# EasyEDA Pro project ESP32_Pico.eprj

# Board PCB1
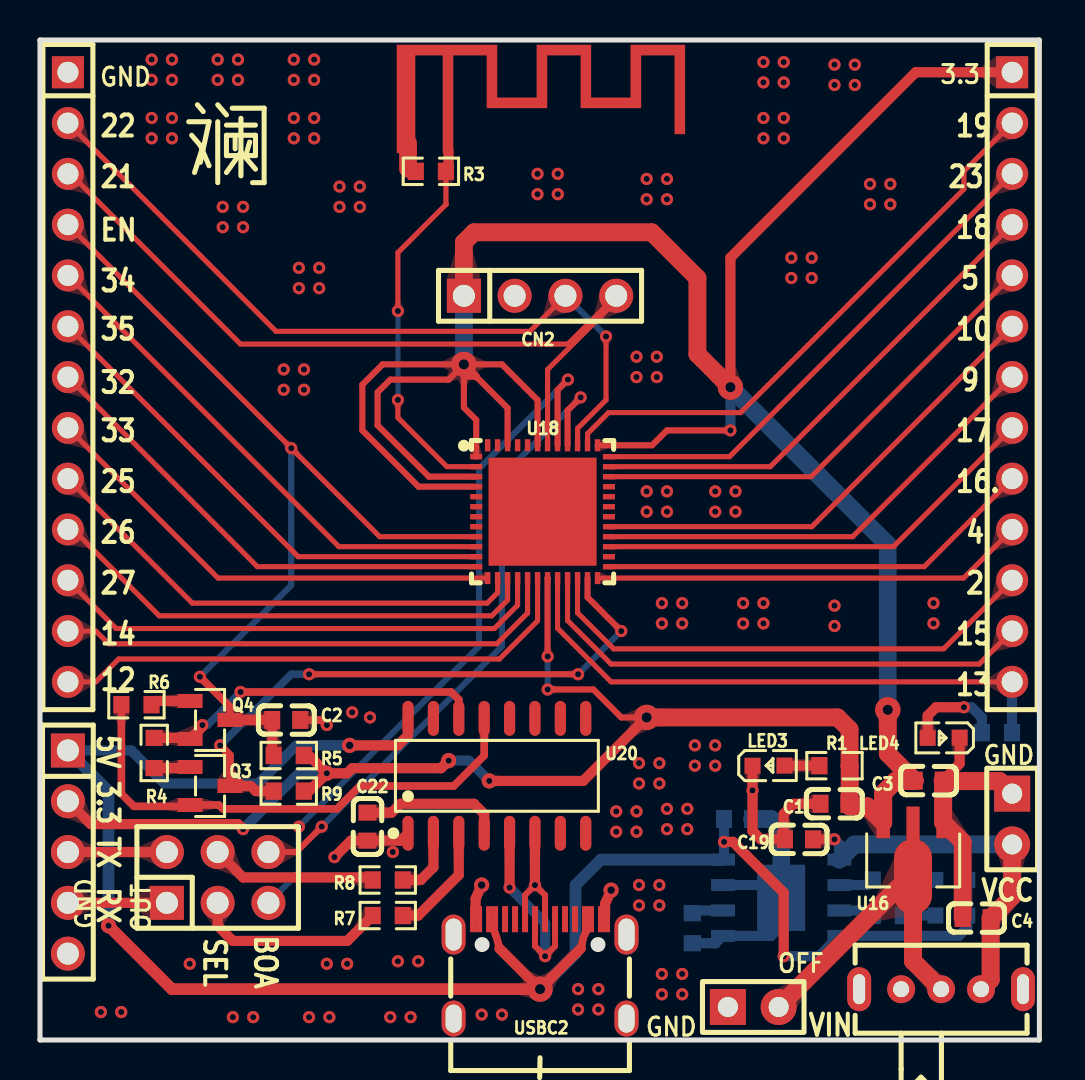
[diagram p0: board, top side]
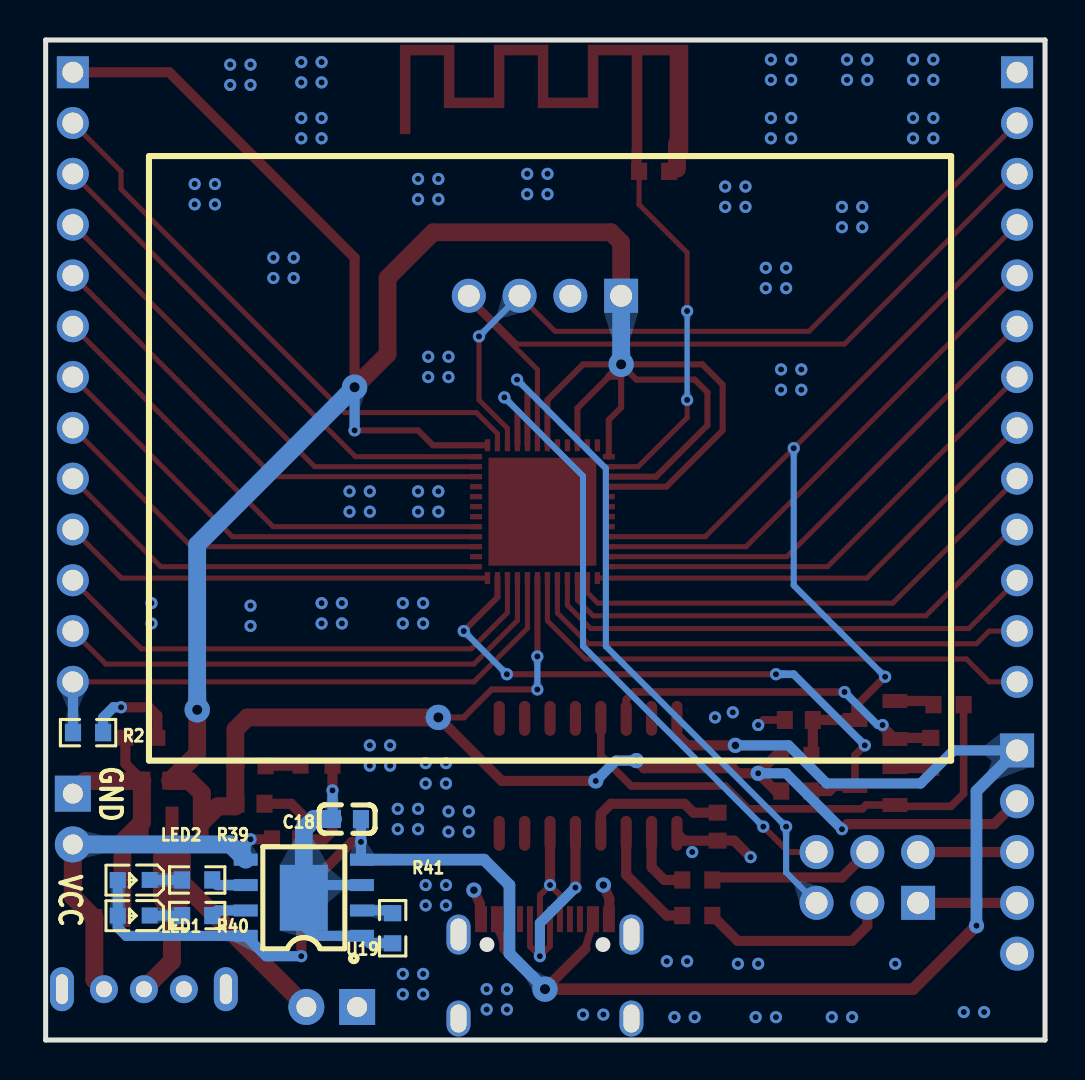
[diagram p1: board, bottom side, seen from below]

Outline 50 x 50 mm; copper layers: Top Layer, Bottom Layer. Coordinates in mm from the lower left corner of the outline.
Outline path: 0,50 0,0 50,0 50,50 0,50
Stack: Top Layer 0.035mm / Dielectric1 1.51mm FR4 er 4.5 / Bottom Layer 0.035mm

## Design rules (mm)
spacing safeClearance (default): track to track 0.152, other pairs 0.152 to 0.3
track width trackWidth (default): min 0.127, default 0.254, max 2.54
differential pair differentialPair (default): width min 0.127, default 0.254, max 2.54; gap min 0.152, default 0.152
via viaSize (default): diameter min 0.5, default 0.61, max 10; hole min 0.3, default 0.305, max 6

## Placement (name value [footprint] x y rotation side)
3.3  PZ254-1-13-Z-8.5  [HDR-TH_13P-P2.54-V-M]  48.64 33.15 270 top
C1  100nF  [C0603]  39.75 11.81 0 top
C2  1UF  [C0603]  12.32 16 180 top
C3  10uF  [C0603]  44.46 12.97 0 top
C4  100nF  [C0603]  46.86 6.1 0 top
C18  10uF  [C0603]  34.93 11.05 0 bottom
C19  10uF  [C0603]  37.97 10.03 180 top
C22  100nF  [C0603]  16.38 10.67 270 top
CN2  A2541WV-4P  [HDR-TH_4P-P2.54-V-M]  25.02 37.21 0 top
GND  -  [HDR-TH_13P-P2.54-V-M]  1.4 33.15 270 top
GND#2  -  [HDR-TH_5P-P2.54-V-M]  1.4 9.4 270 top
GND#3  -  [HDR-TH_2P-P2.54-V-M-1]  48.64 11.05 270 top
GND#4  -  [HDR-TH_2P-P2.54-V-M-1]  35.69 1.65 0 top
LED1  red  [LED0603-RD]  45.59 6.22 0 bottom
LED2  green  [LED0603-RD]  45.59 8 0 bottom
LED3  red  [LED0603-RD]  36.45 13.72 0 top
LED4  blue  [LED0603-RD]  45.21 15.11 180 top
NOREF  -  [Pad_e74]  25.06 48.18 0 top
OFF  SK-12D07-VG3  [SW-TH_SK-12D07-VG3]  45.09 2.54 0 top
OUT  103186-3  [HDR-TH_6P-P2.54-V-M-R2-C3-S2.54-2]  8.89 8.13 0 top
Q3  S8050  [SOT-23-3_L2.9-W1.3-P1.90-LS2.4-BR]  8.51 12.7 180 top
Q4  S8050  [SOT-23-3_L2.9-W1.3-P1.90-LS2.4-BR]  8.51 16 180 top
R1  1K  [R0603]  39.75 13.72 0 top
R2  1K  [R0603]  47.88 15.37 0 bottom
R3  0  [R0603]  19.56 43.43 180 top
R4  10K  [R0603]  5.72 14.35 270 top
R5  10K  [R0603]  12.45 14.22 0 top
R6  10K  [R0603]  4.83 16.76 0 top
R7  100  [R0603]  17.4 6.22 0 top
R8  100  [R0603]  17.4 8 0 top
R9  10K  [R0603]  12.45 12.45 0 top
R39  1K  [R0603]  42.42 8 0 bottom
R40  1K  [R0603]  42.42 6.22 0 bottom
R41  1.2K  [R0603]  32.64 5.59 90 bottom
U16  HT7833-A  [SOT-89_L4.5-W2.5-P1.50-LS4.2-BR]  43.69 9.53 90 top
U18  ESP32-PICO-D4  [LGA-48_L7.0-W7.0-P0.50-BL-EP5.4]  25.15 26.42 270 top
U19  TP4056-42-ESOP8  [ESOP-8_L4.9-W3.9-P1.27-LS6.0-BL-EP]  37.08 7.11 90 bottom
U20  CH340C  [SOP-16_L10.0-W3.9-P1.27-LS6.0-BL]  22.86 13.21 0 top
USBC2  TYPE-C-31-M-12  [USB-C_SMD-TYPE-C-31-M-12]  25.02 3.56 0 top

## Footprints (pads in the part's own frame, mm; a bottom-side part is the same pattern mirrored in y, then rotated)
C0603
  rect 0.8x0.9 smd: 1(-0.7,0) 2(0.7,0)
ESOP-8_L4.9-W3.9-P1.27-LS6.0-BL-EP
  rect 0.6x1.2 smd: 1(-1.905,-2.909) 2(-0.635,-2.909) 3(0.635,-2.909) 4(1.905,-2.909) 5(1.905,2.909) 6(0.635,2.909) 7(-0.635,2.909) 8(-1.905,2.909)
  rect 3.3x2.4 smd: 9(0,0)
HDR-TH_2P-P2.54-V-M-1
  rect 1.8x1.8 hole 1: 1(-1.27,0)
  round 1.8 hole 1: 2(1.27,0)
HDR-TH_4P-P2.54-V-M
  rect 1.7x1.7 hole 1.1: 1(-3.81,0)
  round 1.7 hole 1.1: 2(-1.27,0) 3(1.27,0) 4(3.81,0)
HDR-TH_5P-P2.54-V-M
  rect 1.7x1.7 hole 1.1: 1(-5.08,0)
  round 1.7 hole 1.1: 2(-2.54,0) 3(0,0) 4(2.54,0) 5(5.08,0)
HDR-TH_6P-P2.54-V-M-R2-C3-S2.54-2
  rect 1.7x1.7 hole 1.1: 1(-2.54,-1.27)
  round 1.7 hole 1.1: 2(-2.54,1.27) 3(0,-1.27) 4(0,1.27) 5(2.54,-1.27) 6(2.54,1.27)
HDR-TH_13P-P2.54-V-M
  rect 1.6x1.6 hole 1.05: 1(-15.24,0)
  round 1.6 hole 1.05: 2(-12.7,0) 3(-10.16,0) 4(-7.62,0) 5(-5.08,0) 6(-2.54,0) 7(0,0) 8(2.54,0) 9(5.08,0) 10(7.62,0) 11(10.16,0) 12(12.7,0) 13(15.24,0)
LED0603-RD
  rect 0.8x0.8 smd: 1(-0.799,-0.004) 2(0.799,0.004)
LGA-48_L7.0-W7.0-P0.50-BL-EP5.4
  rect 0.27x0.6 smd: 1(-2.75,-3.32) 2(-2.25,-3.32) 3(-1.75,-3.32) 4(-1.25,-3.32) 5(-0.75,-3.32) 6(-0.25,-3.32) 7(0.25,-3.32) 8(0.75,-3.32) 9(1.25,-3.32) 10(1.75,-3.32) 11(2.25,-3.32) 12(2.75,-3.32) 25(2.75,3.32) 26(2.25,3.32) 27(1.75,3.32) 28(1.25,3.32) 29(0.75,3.32) 30(0.25,3.32) 31(-0.25,3.32) 32(-0.75,3.32) 33(-1.25,3.32) 34(-1.75,3.32) 35(-2.25,3.32) 36(-2.75,3.32)
  rect 0.6x0.27 smd: 13(3.32,-2.75) 14(3.32,-2.25) 15(3.32,-1.75) 16(3.32,-1.25) 17(3.32,-0.75) 18(3.32,-0.25) 19(3.32,0.25) 20(3.32,0.75) 21(3.32,1.25) 22(3.32,1.75) 23(3.32,2.25) 24(3.32,2.75) 37(-3.32,2.75) 38(-3.32,2.25) 39(-3.32,1.75) 40(-3.32,1.25) 41(-3.32,0.75) 42(-3.32,0.25) 43(-3.32,-0.25) 44(-3.32,-0.75) 45(-3.32,-1.25) 46(-3.32,-1.75) 47(-3.32,-2.25) 48(-3.32,-2.75)
  rect 5.4x5.4 smd: 49(0,0)
Pad_e74
  custom 14.425x5.415 smd: 5(0,0)
R0603
  rect 0.806x0.864 smd: 1(-0.753,0) 2(0.753,0)
SOP-16_L10.0-W3.9-P1.27-LS6.0-BL
  oval 0.56x1.745 smd: 1(-4.445,-2.873) 2(-3.175,-2.873) 3(-1.905,-2.873) 4(-0.635,-2.873) 5(0.635,-2.873) 6(1.905,-2.873) 7(3.175,-2.873) 8(4.445,-2.873) 9(4.445,2.873) 10(3.175,2.873) 11(1.905,2.873) 12(0.635,2.873) 13(-0.635,2.873) 14(-1.905,2.873) 15(-3.175,2.873) 16(-4.445,2.873)
SOT-23-3_L2.9-W1.3-P1.90-LS2.4-BR
  rect 1.25x0.7 smd: 1(1,-0.95) 2(1,0.95) 3(-1,0)
SOT-89_L4.5-W2.5-P1.50-LS4.2-BR
  rect 1.575x0.673 smd: 1(1.357,-1.498) 3(1.357,1.501)
  custom 5.378x1.9 smd: 2(-1.357,0.007)
SW-TH_SK-12D07-VG3
  round 1.399 hole 0.8: 1(-1.999,0) 2(0,0) 3(1.999,0)
  oval 1.199x2.2 hole 0.6x1.501: 4(4.099,0) 5(-4.099,0)
USB-C_SMD-TYPE-C-31-M-12
  oval 1.2x2 hole 0.8x1.6: 0(-4.325,1.716) 1(4.325,1.716)
  oval 1.2x1.8 hole 0.8x1.4: 2(4.325,-2.484) 3(-4.325,-2.484)
  rect 0.3x1.3 smd: A1(-3.35,2.484) A4(-2.55,2.484) A5(-1.25,2.484) A6(-0.25,2.484) A7(0.25,2.484) A8(1.25,2.484) A9(2.55,2.484) A12(3.35,2.484) B1(3.05,2.484) B4(2.25,2.484) B5(1.75,2.484) B6(0.75,2.484) B7(-0.75,2.484) B8(-1.75,2.484) B9(-2.25,2.484) B12(-3.05,2.484)

## Nets
3.3V: 3.3.1 C1.2 C3.1 CN2.1 GND#2.2 R1.2 R5.2 R9.2 U16.3 U18.1 U18.3 U18.4 U18.19 U18.37 U18.43 U18.46
GND: C1.1 C2.1 C3.2 C4.1 C18.2 C19.2 C22.2 CN2.2 GND.1 GND#2.5 GND#3.1 GND#4.1 LED3.1 LED4.1 R3.2 R41.1 U16.1 U18.49 U19.1 U19.3 U19.9 U20.1 USBC2.A1 USBC2.A12 USBC2.B1 USBC2.B12
VIN: GND#4.2 OFF.2 U16.2
2: 3.3.11 U18.22
4: 3.3.10 U18.24
5: 3.3.5 U18.34
9: 3.3.7 U18.28
10: 3.3.6 U18.29
12: GND.13 U18.18
13: 3.3.13 R2.2 U18.20
14: GND.12 U18.17
15: 3.3.12 U18.21
16: 3.3.9 U18.25
17: 3.3.8 U18.27
18: 3.3.4 U18.35
19: 3.3.2 U18.38
21: CN2.4 GND.3 U18.42
22: CN2.3 GND.2 U18.39
23: 3.3.3 U18.36
25: GND.9 U18.14
26: GND.10 U18.15
27: GND.11 U18.16
32: GND.7 U18.12
33: GND.8 U18.13
34: GND.5 U18.10
35: GND.6 U18.11
D+: U20.5 USBC2.A6 USBC2.B6
D-: U20.6 USBC2.A7 USBC2.B7
DTR: Q3.2 R6.1 U20.13
EN: C2.2 GND.4 Q4.3 R5.1 U18.9
IO0: Q3.3 R9.1 U18.23
LDA: NOREF.5 R3.1 U18.2
RTS: Q4.2 R4.1 U20.14
RX: OUT.3 R7.1
RX_B: OUT.6 U18.40
RX_OUT: GND#2.4 OUT.1
TX: OUT.4 R8.1
TX_B: OUT.5 U18.41
TX_OUT: GND#2.3 OUT.2
V_BATT: C4.2 C19.1 GND#3.2 OFF.3 U19.5
V_USB: C18.1 GND#2.1 LED1.2 LED2.2 U19.4 U19.8 U20.16 USBC2.A4 USBC2.A9 USBC2.B4 USBC2.B9
$1N1709: R40.1 U19.7
$1N1713: R41.2 U19.2
$1N1714: R39.1 U19.6
$1N1720: LED1.1 R40.2
$1N1725: LED2.1 R39.2
$1N3455: C22.1 U20.4
$1N9297: Q4.1 R6.2
$1N9299: Q3.1 R4.2
$1N21066: LED3.2 R1.1
$1N21327: LED4.2 R2.1
$1N36032: R7.2 U20.3
$1N36033: R8.2 U20.2

Pads without a net: OFF 1 4 5; U18 5 6 7 8 26 30 31 32 33 44 45 47 48; U20 7 8 9 10 11 12 15; USBC2 0 1 2 3 A5 A8 B5 B8

## Via types
v1: diameter 0.61, hole 0.305, Top Layer to Bottom Layer, 163 vias
v2: diameter 0.762, hole 0.381, Top Layer to Bottom Layer, 3 vias
v3: diameter 0.762, hole 0.305, Top Layer to Bottom Layer, 4 vias
v4: diameter 1.27, hole 0.508, Top Layer to Bottom Layer, 5 vias

## Routing (per net, layer and track width the routed paths; a pad name or vN(x,y) marks a point on that pad's centre or on a via; arc(x,y) is an arc through that point)
3.3V: length 192.2
  Top Layer w0.305: U18.37 30.62,29.74 31.37,30.48 v1(34.54,30.48) ; v1(25.4,19.18) 25.4,19.18 U18.19 25.4,23.09 ; U18.4 18.94,27.67 16.13,30.48 16.13,32.77 17.15,33.78 v4(21.21,33.78) ; U18.43 24.9,32 23.11,33.78 v4(21.21,33.78) ; U18.1 21.83,31.01 21.21,31.62 21.21,33.17 21.83,33.17 23.4,31.59 U18.46 ; v1(25.4,17.53) 27.69,17.53 29.08,16.13 v4(30.35,16.13) ; v4(21.21,33.78) 20.45,33.02 17.53,33.02 16.89,32.39 16.89,30.73 19.46,28.17 U18.3
  Top Layer w0.381: 21.83,33.17 v4(21.21,33.78)
  Top Layer w0.508: GND#2.2 2.54,10.8 9.91,10.8 v1(10.16,10.54) ; v4(34.54,32.64) 34.54,39.12 43.81,48.39 3.3.1 ; v3(22.48,12.95) 27.18,12.95 v4(30.35,16.13) ; v3(14.35,13.33) 13.46,14.22 R5.2 ; v3(14.35,13.33) 15.37,13.33 15.62,13.59 20.07,13.59 v3(20.45,13.97) ; v3(14.35,13.33) 13.46,12.45 R9.2
  Top Layer w0.889: v4(30.35,16.13) 39.91,16.13 40.5,15.53 R1.2 ; CN2.1 21.21,39.88 21.72,40.39 30.61,40.39 32.89,38.1 32.89,34.29 v4(34.54,32.64) ; C3.1 42.42,14.31 v4(42.42,16.51)
  Top Layer w0.899: C3.1 43.75,12.95 42.8,12.95 42.19,12.34 42.19,10.88 41.38,11.68 40.51,11.68 40.51,13.71 R1.2
  Bottom Layer w0.305: v1(25.4,19.18) v1(25.4,17.53)
  Bottom Layer w0.508: v3(22.48,12.95) 21.46,13.97 v3(20.45,13.97) ; v1(34.54,30.48) v4(34.54,32.64) ; v1(10.16,10.54) 12.95,13.33 v3(14.35,13.33)
  Bottom Layer w0.889: v4(42.42,16.51) 42.42,24.77 v4(34.54,32.64) ; v4(21.21,33.78) CN2.1
GND: length 47.5
  Top Layer w0.381: v1(14.35,15.75) 14.1,16 13.02,16
  Top Layer w0.508: v2(22.1,7.75) 21.8,7.06 21.8,6.4 ; v2(28.57,7.49) 28.27,6.81 28.27,6.15 ; U20.1 18.05,9.97 C22.2 15.56,9.97 v1(14.73,9.14) ; C3.2 46.01,13.82 LED4.1 ; LED3.1 v1(35.65,12.48) 35.65,10.45 36.07,10.03 37.27,10.03 37.21,10.09 37.21,11.3 37.72,11.81 C1.1
  Top Layer w0.889: 18.41,43.56 18.41,44.83 ; C4.1 46.16,9.91 U16.1
  Top Layer w0.899: GND.1 48.01,12.95 45.19,12.95 ; 45.19,12.95 C3.2 ; 45.19,12.95 U16.1
  Bottom Layer w0.508: R41.1 33.79,4.83 34.16,5.21 U19.1 36.58,5.21 37.08,5.72 U19.9 36.45,7.75 U19.3 ; C18.2 35.65,11.07 v1(35.65,12.48)
  Bottom Layer w0.889: C18.2 36.58,11.05 37.08,10.54 U19.9
  vias: v1(3.05,1.4) v1(4.06,1.4) v1(5.59,49.02) v1(5.59,48.01) v1(5.59,46.1) v1(5.59,45.08) v1(6.6,49.02) v1(6.6,48.01) v1(6.6,46.1) v1(6.6,45.08) v1(7.49,3.81) v1(8.89,49.02) v1(8.89,48.01) v1(9.14,41.66) v1(9.14,40.64) v1(9.65,1.14) v1(9.91,49.02) v1(9.91,48.01) v1(10.16,41.66) v1(10.16,40.64) v1(10.67,1.14) v1(12.19,33.53) v1(12.19,32.51) v1(12.7,49.02) v1(12.7,48.01) v1(12.7,46.1) v1(12.7,45.08) v1(12.95,38.61) v1(12.95,37.59) v1(13.21,33.53) v1(13.21,32.51) v1(13.46,1.14) v1(13.72,49.02) v1(13.72,48.01) v1(13.72,46.1) v1(13.72,45.08) v1(13.97,38.61) v1(13.97,37.59) v1(14.35,3.81) v1(14.48,1.14) v1(14.99,42.67) v1(14.99,41.66) v1(15.37,3.81) v1(15.62,16.38) v1(16,42.67) v1(16,41.66) v1(16.51,16.13) v1(17.53,1.14) v1(17.65,9.4) v1(17.91,3.94) v1(18.54,1.14) v1(18.92,3.94) v1(22.1,1.27) v1(23.11,1.27) v1(24.89,43.31) v1(24.89,42.29) v1(25.91,43.31) v1(25.91,42.29) v1(26.92,2.54) v1(26.92,1.53) v1(27.94,2.54) v1(27.94,1.53) v1(28.83,11.43) v1(28.83,10.41) v1(29.84,34.16) v1(29.84,33.15) v1(29.84,11.43) v1(29.84,10.41) v1(29.97,13.84) v1(29.97,12.83) v1(29.97,7.75) v1(29.97,6.73) v1(30.35,43.05) v1(30.35,42.04) v1(30.35,27.43) v1(30.35,26.42) v1(30.86,34.16) v1(30.86,33.15) v1(30.99,13.84) v1(30.99,12.83) v1(30.99,7.75) v1(30.99,6.73) v1(31.12,21.84) v1(31.12,20.83) v1(31.12,3.3) v1(31.12,2.29) v1(31.37,43.05) v1(31.37,42.04) v1(31.37,27.43) v1(31.37,26.42) v1(31.37,11.56) v1(31.37,10.54) v1(32.13,21.84) v1(32.13,20.83) v1(32.13,3.3) v1(32.13,2.29) v1(32.38,11.56) v1(32.38,10.54) v1(32.77,14.73) v1(32.77,13.72) v1(33.78,27.43) v1(33.78,26.42) v1(33.78,14.73) v1(33.78,13.72) v1(34.8,27.43) v1(34.8,26.42) v1(35.18,21.84) v1(35.18,20.83) v1(36.19,48.89) v1(36.19,47.88) v1(36.19,46.1) v1(36.19,45.08) v1(36.19,21.84) v1(36.19,20.83) v1(37.21,48.89) v1(37.21,47.88) v1(37.21,46.1) v1(37.21,45.08) v1(37.59,39.12) v1(37.59,38.1) v1(38.61,39.12) v1(38.61,38.1) v1(39.75,48.77) v1(39.75,47.75) v1(39.75,21.72) v1(39.75,20.7) v1(40.77,48.77) v1(40.77,47.75) v1(41.53,42.8) v1(41.53,41.78) v1(42.54,42.8) v1(42.54,41.78) v1(44.7,21.84) v1(44.7,20.83)
VIN: length 15.6
  Top Layer w0.889: 36.96,1.65 43.47,8.17 U16.2
  Top Layer w0.899: OFF.2 43.68,3.94 U16.2
2: length 25.6
  Top Layer w0.254: 3.3.11 45.21,19.56 28.7,19.56 26.9,21.36 U18.22
4: length 21.8
  Top Layer w0.254: U18.24 46.21,23.1 3.3.10
5: length 24.3
  Top Layer w0.254: U18.34 38.58,28.17 3.3.5
9: length 23.5
  Top Layer w0.254: U18.28 40.66,25.17 3.3.7
10: length 24.3
  Top Layer w0.254: 3.3.6 38.62,25.67 U18.29
12: length 26.9
  Top Layer w0.254: U18.18 24.9,20.96 22.99,19.05 3.94,19.05 2.79,17.91 GND.13
13: length 28.9
  Top Layer w0.254: U18.20 25.9,20.59 28.57,17.91 3.3.13
  Bottom Layer w0.508: R2.2 48.63,17.9 3.3.13
14: length 25.6
  Top Layer w0.254: GND.12 2.79,20.45 3.43,19.81 22.86,19.81 24.4,21.35 U18.17
15: length 26
  Top Layer w0.254: 3.3.12 46.99,18.8 28.57,18.8 26.4,20.97 U18.21
16: length 22
  Top Layer w0.254: 3.3.9 44.24,23.67 U18.25
17: length 22.6
  Top Layer w0.254: 3.3.8 42.7,24.67 U18.27
18: length 25.2
  Top Layer w0.254: U18.35 36.54,28.67 3.3.4
19: length 28.8
  Top Layer w0.254: 3.3.2 46.23,43.43 46.23,42.55 35.05,31.37 28.45,31.37 27.4,30.32 U18.38
21: length 40.9
  Top Layer w0.254: U18.42 25.4,33.52 28.83,36.96 CN2.4 26.42,34.8 10.03,34.8 1.52,43.31 GND.3
22: length 38.8
  Top Layer w0.254: v1(28.32,35.18) 28.32,32 26.9,30.58 U18.39 ; 26.29,37.21 24.51,35.43 11.81,35.43 GND.2
  Bottom Layer w0.305: v1(28.32,35.18) 26.29,37.21
23: length 26
  Top Layer w0.254: U18.36 34.5,29.17 3.3.3
25: length 25
  Top Layer w0.254: U18.14 22.9,22.36 22.38,21.84 7.62,21.84 GND.9
26: length 25.2
  Top Layer w0.254: U18.15 23.4,22 22.61,21.21 5.97,21.21 1.65,25.53 GND.10
27: length 25.3
  Top Layer w0.254: GND.11 3.81,20.57 22.73,20.57 23.9,21.74 U18.16
32: length 24.4
  Top Layer w0.254: GND.7 10.88,23.67 U18.12
33: length 24.1
  Top Layer w0.254: GND.8 8.91,23.1 U18.13
34: length 26
  Top Layer w0.254: U18.10 14.96,24.67 GND.5
35: length 25.2
  Top Layer w0.254: U18.11 12.92,24.17 GND.6
D+: length 11
  Top Layer w0.299: USBC2.A6 24.77,4.69 v1(25.27,4.19) 25.77,4.69 USBC2.B6
  Top Layer w0.508: v1(23.5,7.62) U20.5
  Bottom Layer w0.508: v1(23.5,7.62) 25.27,5.84 v1(25.27,4.19)
D-: length 6.4
  Top Layer w0.299: USBC2.B7 24.27,7.25 v1(24.76,7.75) 25.27,7.24 USBC2.A7
  Top Layer w0.508: 24.76,10.34 v1(24.76,7.75)
DTR: length 25.9
  Top Layer w0.381: R6.1 4.07,12.31 4.7,11.68 7.44,11.68 Q3.2 8.95,11.75 9.14,11.56 14.86,11.56 16,12.7 20.7,12.7 22.22,14.22 22.22,16.08
EN: length 46.9
  Top Layer w0.254: GND.4 v1(12.57,29.59) 17,25.17 U18.9
  Top Layer w0.381: Q4.3 9.51,16.65 v1(8,18.16)
  Top Layer w0.508: Q4.3 C2.2 11.62,14.3 R5.1
  Bottom Layer w0.305: v1(8,18.16) 12.57,22.73 v1(12.57,29.59)
IO0: length 30.3
  Top Layer w0.305: v1(26.92,18.29) v1(13.46,18.29) ; U18.23 27.4,22.13 v1(29.08,20.45)
  Top Layer w0.381: v1(9.02,14.73) 9.51,14.24 Q3.3
  Top Layer w0.508: Q3.3 10.54,12.7 10.79,12.45 R9.1
  Bottom Layer w0.305: v1(26.92,18.29) v1(29.08,20.45)
  Bottom Layer w0.381: v1(13.46,18.29) 12.57,18.29 v1(9.02,14.73)
LDA: length 19.2
  Top Layer w0.254: v1(17.91,36.45) 17.91,39.37 20.32,41.78 20.31,41.79 R3.1 ; v1(17.91,32) 17.91,31.11 20.36,28.67 U18.2
  Top Layer w0.508: 20.44,43.56 20.44,44.46
  Bottom Layer w0.254: v1(17.91,36.45) v1(17.91,32)
RTS: length 17.4
  Top Layer w0.381: v1(10.03,17.4) 20.57,17.4 20.96,17.02 U20.14 ; 7.46,15.1 Q4.2
  Top Layer w0.508: R4.1 7.46,15.1 ; Q4.2 8.13,15.67 v1(8.13,15.75)
  Bottom Layer w0.381: v1(10.03,17.4) 8.38,15.75 v1(8.13,15.75)
RX: length 9.7
  Top Layer w0.508: R7.1 15.38,4.95 9.65,4.95 8.89,5.72 OUT.3
RX_B: length 32.7
  Top Layer w0.305: v1(27.05,32.13) 26.4,31.48 U18.40 ; v1(14.1,10.67) 12.83,9.4 OUT.6
  Bottom Layer w0.305: v1(27.05,32.13) 23.11,28.19 23.11,19.69 v1(14.1,10.67)
RX_OUT: length 5
  Top Layer w0.508: GND#2.4 OUT.1
TX: length 8.3
  Top Layer w0.508: R8.1 16.52,8.13 10.16,8.13 OUT.4
TX_B: length 35.9
  Top Layer w0.305: U18.41 25.9,32.5 v1(26.42,33.02)
  Bottom Layer w0.305: OUT.5 12.95,8.38 v1(12.95,10.67) 21.97,19.69 21.97,28.58 v1(26.42,33.02)
TX_OUT: length 5
  Top Layer w0.508: GND#2.3 OUT.2
V_BATT: length 19
  Top Layer w0.508: C19.1 v1(39.75,10.03)
  Top Layer w0.899: GND#3.2 48.64,7.17 C4.2 47.56,3.02 OFF.3
  Bottom Layer w0.508: U19.5 39.99,9.79 v1(39.75,10.03)
  Bottom Layer w0.889: GND#3.2 40.75,9.78 U19.5
V_USB: length 93
  Top Layer w0.508: 24.64,2.92 22.99,4.58 ; v1(37.21,4.19) 37.21,7.37 34.67,9.91 34.29,9.91 ; v2(15.49,14.73) 17.91,14.73 18.41,15.24 U20.16 ; v4(25.02,2.54) 27.05,4.58
  Top Layer w0.584: v3(3.43,5.72) 6.6,2.54 v4(25.02,2.54) 24.64,2.92
  Bottom Layer w0.508: 34.22,11.05 v1(34.22,9.91) 34.22,9.07 U19.4 ; v1(37.21,4.19) 38.98,4.19 U19.8 45.97,5.21 46.39,5.63 LED1.2 LED2.2 ; v2(15.49,14.73) 12.83,14.73 10.92,12.83 6.22,12.83 4.57,14.48 GND#2.1
  Bottom Layer w0.584: GND#2.1 3.43,12.45 v3(3.43,5.72) ; v4(25.02,2.54) 26.8,4.32 26.8,7.75 28.07,9.02 U19.4
$1N1709: length 1.8
  Bottom Layer w0.508: R40.1 41.41,6.48 U19.7
$1N1713: length 1.6
  Bottom Layer w0.508: U19.2 32.77,6.48 R41.2
$1N1714: length 1.8
  Bottom Layer w0.508: R39.1 41.41,7.75 U19.6
$1N1720: length 1.6
  Bottom Layer w0.508: LED1.1 44.79,6.22 R40.2
$1N1725: length 1.6
  Bottom Layer w0.508: R39.2 44.79,8 LED2.1
$1N3455: length 7.2
  Top Layer w0.508: C22.1 17.59,11.37 18.03,11.81 21.72,11.81 22.22,11.3 22.22,10.34
$1N9297: length 2
  Top Layer w0.508: R6.2 5.77,16.95 Q4.1
$1N9299: length 1.8
  Top Layer w0.508: R4.2 7.46,13.6 Q3.1
$1N21066: length 1.8
  Top Layer w0.508: LED3.2 37.25,13.72 R1.1
$1N21327: length 5
  Top Layer w0.508: LED4.2 44.41,16.22 44.83,16.64 v1(46.23,16.64)
  Bottom Layer w0.508: v1(46.23,16.64) 46.61,16.64 47.13,16.12 R2.1
$1N36032: length 5.7
  Top Layer w0.508: R7.2 18.92,6.22 20.96,8.25 U20.3
$1N36033: length 3.5
  Top Layer w0.508: U20.2 19.69,8.64 19.05,8 R8.2

## Copper pours and planes (outline as drawn; the poured copper is in the pictures)
GND on Top Layer: 0,50 50,50 50,0 0,0
GND on Bottom Layer: 0,50 50,50 50,0 0,0

Small or netless copper shapes (teardrops, artwork), in the pictures only: 163 on Top Layer, 60 on Bottom Layer

## Text on the board
Bottom Silkscreen Layer: GND | VCC
Top Silkscreen Layer: 21 | EN | 34 | 35 | 32 | 33 | 25 | 26 | 27 | 14 | 12 | 23 | 19 | 18 | 10 | 17 | 16. | 15 | 13 | 5 | 9 | 4 | 2 | VCC | 22 | 5V | 3.3 | TX | RX | SEL | BOA | VIN | 斓
